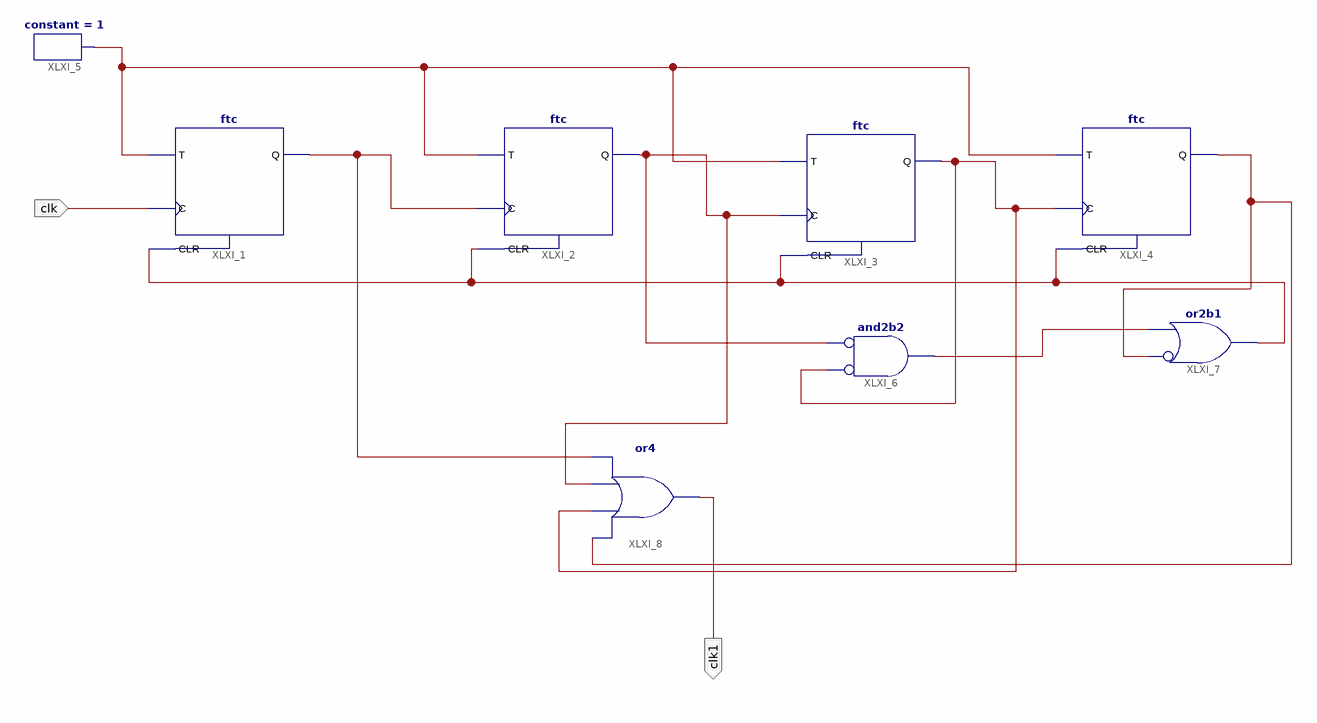
[diagram p0: schematic sheet 1]
// Xilinx ISE schematic lab_5_3.sch (spartan6) as structural Verilog: 8 symbols, 2 ports
module lab_5_3 (
  input  clk,
  output clk1
);

  wire XLXN_4, XLXN_7, XLXN_11, XLXN_12, XLXN_13, XLXN_14, XLXN_15;

  ftc XLXI_1 (.C(clk), .CLR(XLXN_15), .T(XLXN_4), .Q(XLXN_11));
  ftc XLXI_2 (.C(XLXN_11), .CLR(XLXN_15), .T(XLXN_4), .Q(XLXN_12));
  ftc XLXI_3 (.C(XLXN_12), .CLR(XLXN_15), .T(XLXN_4), .Q(XLXN_13));
  ftc XLXI_4 (.C(XLXN_13), .CLR(XLXN_15), .T(XLXN_4), .Q(XLXN_14));
  constant #(.CValue("1")) XLXI_5 (.O(XLXN_4));
  and XLXI_6 (XLXN_7, ~XLXN_13, ~XLXN_12);  // and2b2
  or XLXI_7 (XLXN_15, ~XLXN_14, XLXN_7);  // or2b1
  or XLXI_8 (clk1, XLXN_14, XLXN_13, XLXN_12, XLXN_11);
endmodule
